# Altium schematic sheet [MP] Power Diagram.SchDoc
size 254 x 208 mm; SheetNumber: 6; SheetTotal: 8
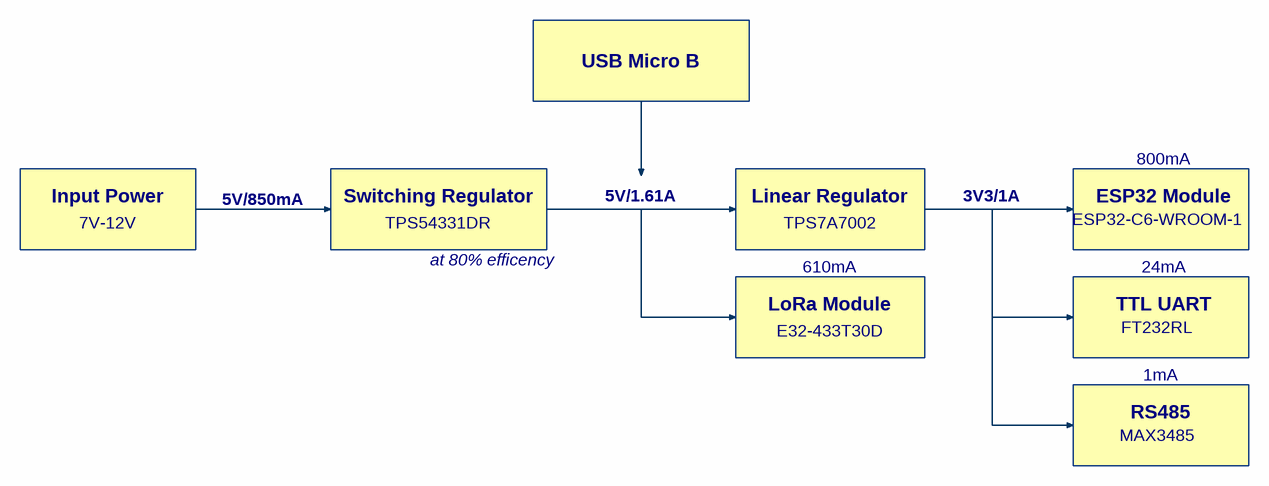
[diagram p0: [MP] Power Diagram.SchDoc]

## Notes on the sheet
- USB Micro B
- Input Power
- 5V/850mA
- Switching Regulator
- 5V/1.61A
- Linear Regulator
- 3V3/1A
- ESP32 Module
- 800mA
- 7V-12V
- TPS54331DR
- at 80% efficency
- TPS7A7002
- 610mA
- ESP32-C6-WROOM-1
- 24mA
- LoRa Module
- E32-433T30D
- FT232RL
- TTL UART
- 1mA
- MAX3485
- RS485
- Title
- Size
- Date:
- A4
- Number
- Check by:
- Revision
- Sheet of:
- Draw by: